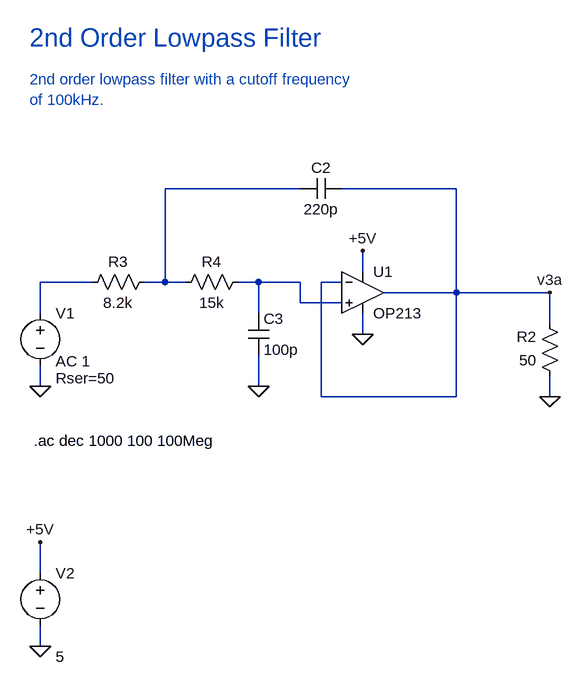
[diagram p0: schematic LowpassFilterSimulation.asc]
LowpassFilterSimulation.asc, the LTspice schematic file:
Version 4
SHEET 1 880 772
WIRE -80 16 -288 16
WIRE 160 16 -16 16
WIRE 16 144 16 112
WIRE -400 160 -480 160
WIRE -288 160 -288 16
WIRE -288 160 -320 160
WIRE -256 160 -288 160
WIRE -144 160 -176 160
WIRE -80 160 -144 160
WIRE -16 160 -48 160
WIRE 160 176 160 16
WIRE 160 176 48 176
WIRE 304 176 160 176
WIRE -80 192 -80 160
WIRE -16 192 -80 192
WIRE -480 208 -480 160
WIRE -144 208 -144 160
WIRE 304 224 304 176
WIRE 16 240 16 208
WIRE -480 320 -480 288
WIRE -144 320 -144 272
WIRE -48 336 -48 160
WIRE 160 336 160 176
WIRE 160 336 -48 336
WIRE 304 336 304 304
WIRE -480 608 -480 560
WIRE -480 720 -480 688
FLAG 304 336 0
FLAG 304 176 v3a
FLAG 16 112 +5V
FLAG 16 240 0
FLAG -144 320 0
FLAG -480 320 0
FLAG -480 720 0
FLAG -480 560 +5V
SYMBOL res 320 320 R180
WINDOW 0 36 76 Left 2
WINDOW 3 36 40 Left 2
SYMATTR InstName R2
SYMATTR Value 50
SYMBOL res -304 144 R90
WINDOW 0 0 56 VBottom 2
WINDOW 3 32 56 VTop 2
SYMATTR InstName R3
SYMATTR Value 8.2k
SYMBOL res -160 144 R90
WINDOW 0 0 56 VBottom 2
WINDOW 3 32 56 VTop 2
SYMATTR InstName R4
SYMATTR Value 15k
SYMBOL cap -16 0 R90
WINDOW 0 0 32 VBottom 2
WINDOW 3 32 32 VTop 2
SYMATTR InstName C2
SYMATTR Value 220p
SYMBOL cap -160 208 R0
SYMATTR InstName C3
SYMATTR Value 100p
SYMBOL Opamps\\OP213 16 112 R0
SYMATTR InstName U1
SYMBOL voltage -480 192 R0
WINDOW 123 24 90 Left 2
WINDOW 39 24 116 Left 2
SYMATTR InstName V1
SYMATTR Value ""
SYMATTR Value2 AC 1
SYMATTR SpiceLine Rser=50
SYMBOL voltage -480 592 R0
WINDOW 3 24 144 Left 2
WINDOW 123 24 90 Left 2
WINDOW 39 24 116 Left 2
SYMATTR InstName V2
SYMATTR Value 5
TEXT -496 -216 Left 4 ;2nd Order Lowpass Filter
TEXT -496 -152 Left 2 ;2nd order lowpass filter with a cutoff frequency \nof 100kHz.
TEXT -490 404 Left 2 !.ac dec 1000 100 100Meg

The netlist it stands for:
* LowpassFilterSimulation.asc
R2 0 v3a 50
R3 N001 N002 8.2k
R4 N003 N001 15k
C2 v3a N001 220p
C3 N003 0 100p
XU1 N003 v3a +5V 0 v3a OP213  ; pins In+ In- V+ V- OUT
V1 N002 0 AC 1 Rser=50
V2 +5V 0 5
* 2nd Order Lowpass Filter
* 2nd order lowpass filter with a cutoff frequency
* of 100kHz.
.ac dec 1000 100 100Meg
.backanno
.end